# Altium project PROC114E3_SCH.PrjPcb (part 7 of 22)

## Sheet 18.SchDoc
size 513 x 386 mm
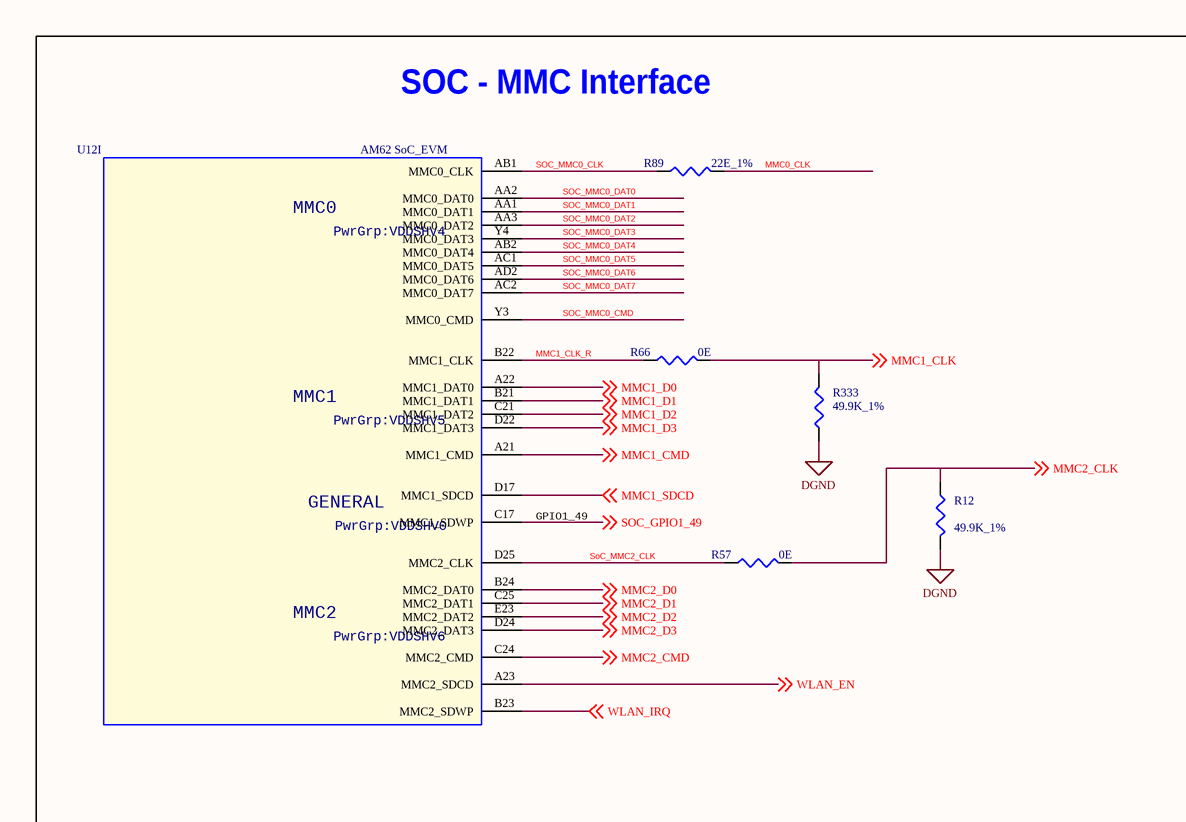
[diagram p27: 18.SchDoc, left]
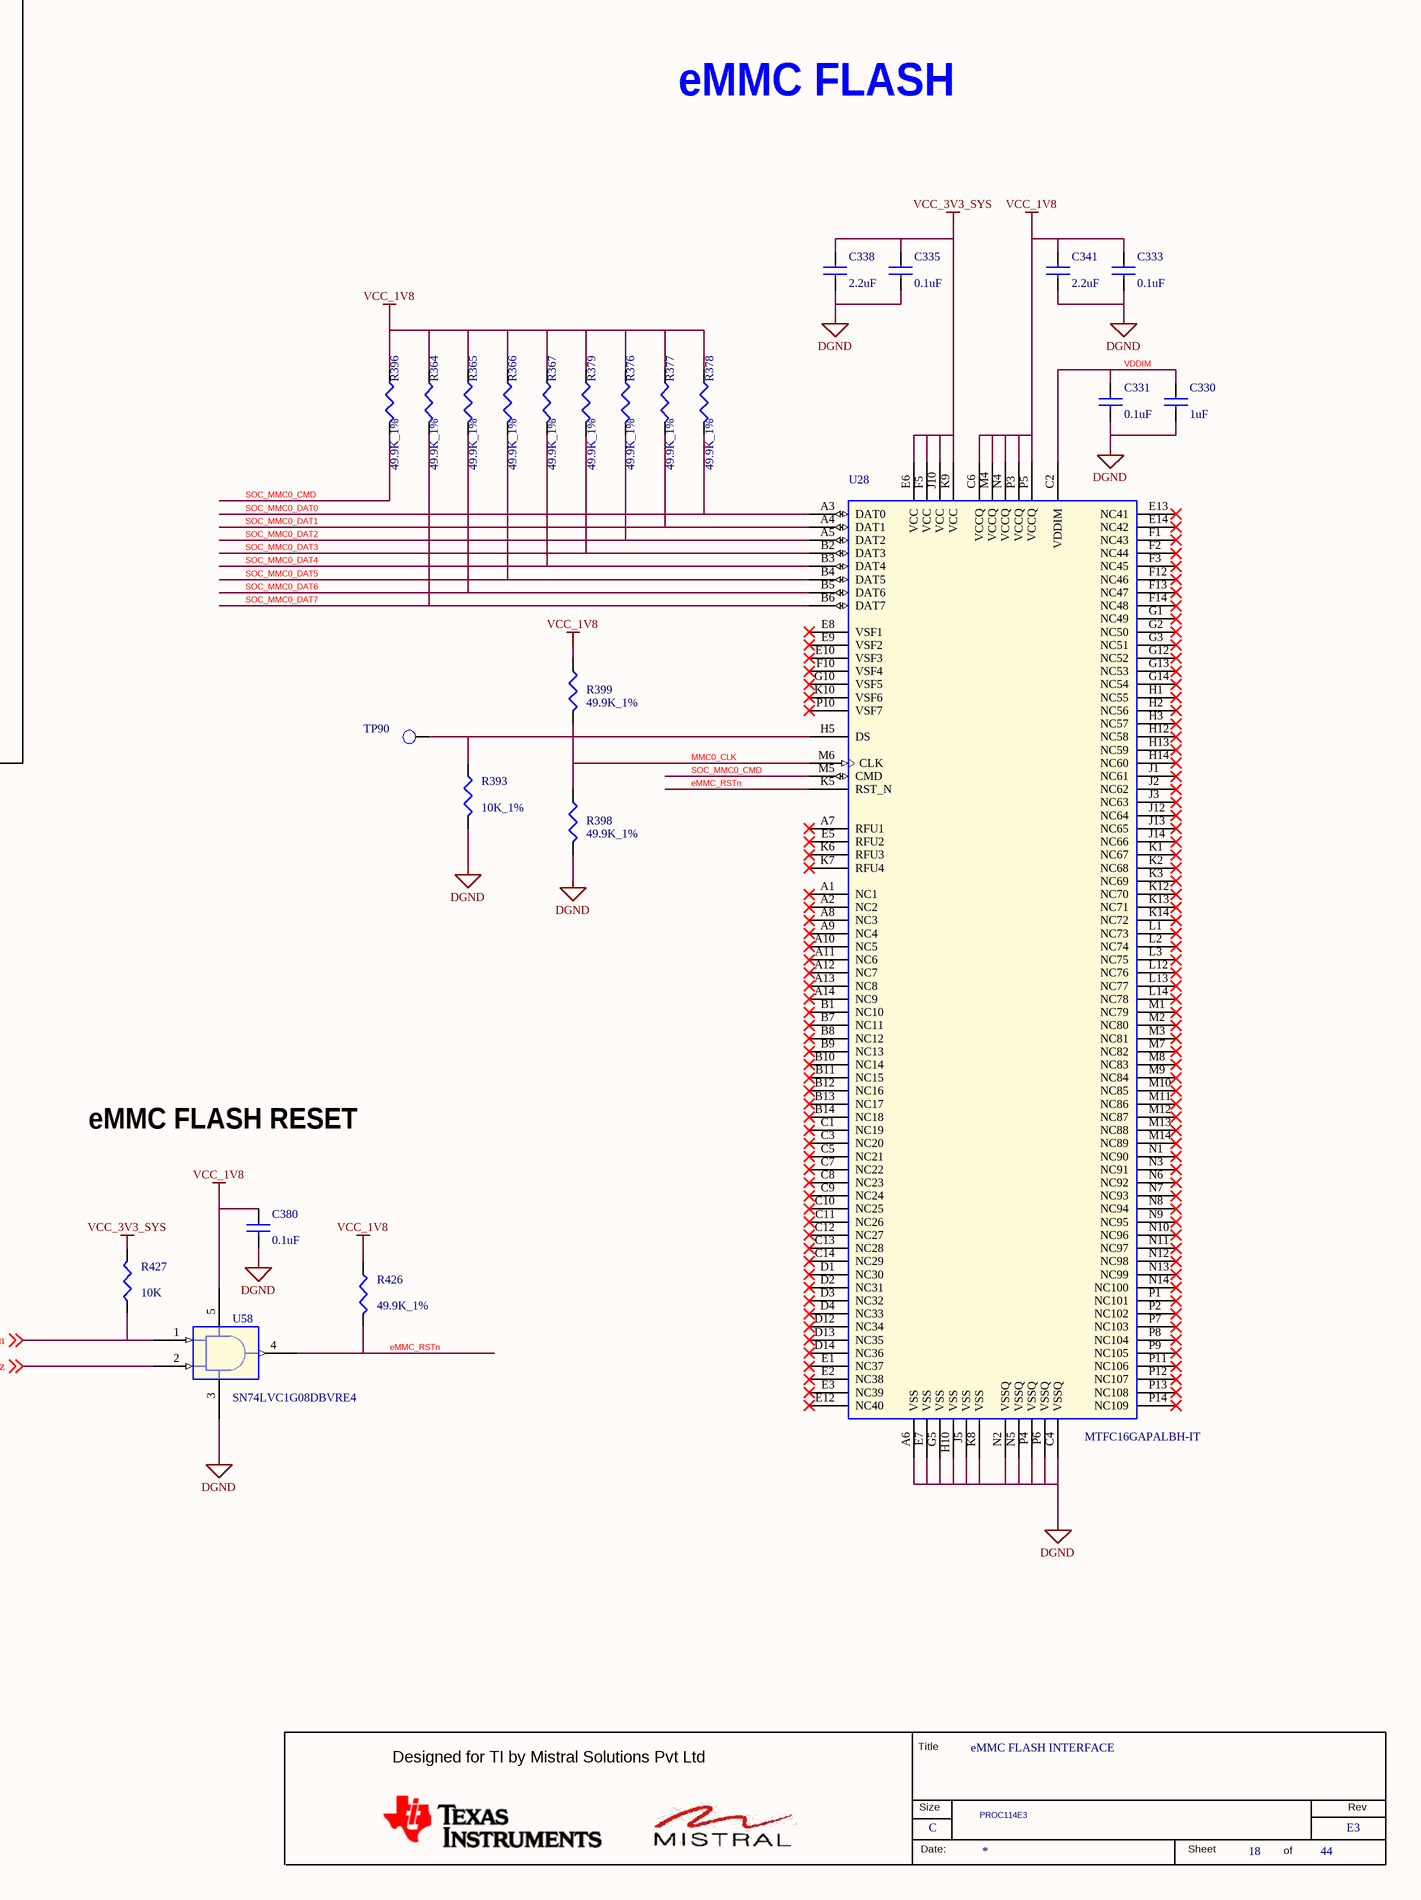
[diagram p28: 18.SchDoc, right]

### Parts
(Parts that share a designator on the sheet are numbered #1, #2 ... from top to bottom, then left to right.)
*#18  RevCode: E3  Title: eMMC FLASH INTERFACE  Page Size: C  Page Number: 18  Page Count: 44  Variant Name: PROC114E3  (hidden comment: MISTRAL_TITLEBLK_CSIZE)  (graphical)
C330  1uF  [CAP0201_0-5]
C331  0.1uF  [CAP0402_0-75]
C333  0.1uF  [CAP0402_0-75]
C335  0.1uF  [CAP0402_0-75]
C338  2.2uF  [CAP0402_0-75]
C341  2.2uF  [CAP0402_0-75]
C380  0.1uF  [CAP0402_0-75]
R12  49.9K_1%  [RES0402_0-5]
R57  0E  [RES0201_0-5]
R66  0E  [RES0201_0-5]
R89  22E_1%  [RES0201_0-5]
R333  49.9K_1%  [RES0402_0-5]
R364  49.9K_1%  [RES0201_0-5]
R365  49.9K_1%  [RES0201_0-5]
R366  49.9K_1%  [RES0201_0-5]
R367  49.9K_1%  [RES0201_0-5]
R376  49.9K_1%  [RES0201_0-5]
R377  49.9K_1%  [RES0201_0-5]
R378  49.9K_1%  [RES0201_0-5]
R379  49.9K_1%  [RES0201_0-5]
R393  10K_1%  [RES0201_0-5]
R396  49.9K_1%  [RES0201_0-5]
R398  49.9K_1%  [RES0402_0-5]
R399  49.9K_1%  [RES0402_0-5]
R426  49.9K_1%  [RES0402_0-5]
R427  10K  [RES0201_0-5]
TP90  TP20_SMD  [TP20_SMD]  (value not drawn)
U12#2  AM62 SoC_EVM  [BGA425_19-68_510X510_0-7]  (part I of 18)
U28  MTFC16GAPALBH-IT  [VFBGA153_19-68_460X520_1-1]
U58  SN74LVC1G08DBVRE4  [SOT23-5]

### Blocks framed on the sheet
SOC - MMC Interface: R12 R57 R66 R89 R333 U12#2

### Nets
DGND: C330.2 C331.2 C333.2 C335.2 C338.2 C341.2 C380.2 R12.2 R333.2 R393.2 R398.2 U28.A6(VSS) U28.C4(VSSQ) U28.E7(VSS) U28.G5(VSS) U28.H10(VSS) U28.J5(VSS) U28.K8(VSS) U28.N2(VSSQ) U28.N5(VSSQ) U28.P4(VSSQ) U28.P6(VSSQ) U58.3(GND)
VCC_1V8: C333.1 C341.1 C380.1 R364.1 R365.1 R366.1 R367.1 R376.1 R377.1 R378.1 R379.1 R396.1 R399.1 R426.1 U28.C6(VCCQ) U28.M4(VCCQ) U28.N4(VCCQ) U28.P3(VCCQ) U28.P5(VCCQ) U58.5(VCC)
VCC_3V3_SYS: C335.1 C338.1 R427.2 U28.E6(VCC) U28.F5(VCC) U28.J10(VCC) U28.K9(VCC)
eMMC_RSTn: R426.2 U28.K5(RST_N) U58.4(Y)
GPIO_eMMC_RSTn: R427.1 U58.1(A) ; off-sheet GPIO_eMMC_RSTn
MMC0_CLK: R89.1 R398.1 R399.2 U28.M6(CLK)
MMC1_CLK: R66.1 R333.1 ; off-sheet MMC1_CLK
MMC1_CLK_R: R66.2 U12#2.B22(MMC1_CLK)
MMC1_CMD: U12#2.A21(MMC1_CMD) ; off-sheet MMC1_CMD
MMC1_D0: U12#2.A22(MMC1_DAT0) ; off-sheet MMC1_D0
MMC1_D1: U12#2.B21(MMC1_DAT1) ; off-sheet MMC1_D1
MMC1_D2: U12#2.C21(MMC1_DAT2) ; off-sheet MMC1_D2
MMC1_D3: U12#2.D22(MMC1_DAT3) ; off-sheet MMC1_D3
MMC1_SDCD: U12#2.D17(MMC1_SDCD) ; off-sheet MMC1_SDCD
MMC2_CLK: R12.1 R57.2 ; off-sheet MMC2_CLK
MMC2_CMD: U12#2.C24(MMC2_CMD) ; off-sheet MMC2_CMD
MMC2_D0: U12#2.B24(MMC2_DAT0) ; off-sheet MMC2_D0
MMC2_D1: U12#2.C25(MMC2_DAT1) ; off-sheet MMC2_D1
MMC2_D2: U12#2.E23(MMC2_DAT2) ; off-sheet MMC2_D2
MMC2_D3: U12#2.D24(MMC2_DAT3) ; off-sheet MMC2_D3
RESETSTATz: U58.2(B) ; off-sheet RESETSTATz
SOC_GPIO1_49: U12#2.C17(MMC1_SDWP) ; off-sheet SOC_GPIO1_49
SOC_MMC0_CLK: R89.2 U12#2.AB1(MMC0_CLK)
SOC_MMC0_CMD: R396.2 U12#2.Y3(MMC0_CMD) U28.M5(CMD)
SOC_MMC0_DAT0: R378.2 U12#2.AA2(MMC0_DAT0) U28.A3(DAT0)
SOC_MMC0_DAT1: R377.2 U12#2.AA1(MMC0_DAT1) U28.A4(DAT1)
SOC_MMC0_DAT2: R376.2 U12#2.AA3(MMC0_DAT2) U28.A5(DAT2)
SOC_MMC0_DAT3: R379.2 U12#2.Y4(MMC0_DAT3) U28.B2(DAT3)
SOC_MMC0_DAT4: R367.2 U12#2.AB2(MMC0_DAT4) U28.B3(DAT4)
SOC_MMC0_DAT5: R366.2 U12#2.AC1(MMC0_DAT5) U28.B4(DAT5)
SOC_MMC0_DAT6: R365.2 U12#2.AD2(MMC0_DAT6) U28.B5(DAT6)
SOC_MMC0_DAT7: R364.2 U12#2.AC2(MMC0_DAT7) U28.B6(DAT7)
SoC_MMC2_CLK: R57.1 U12#2.D25(MMC2_CLK)
VDDIM: C330.1 C331.1 U28.C2(VDDIM)
WLAN_EN: U12#2.A23(MMC2_SDCD) ; off-sheet WLAN_EN
WLAN_IRQ: U12#2.B23(MMC2_SDWP) ; off-sheet WLAN_IRQ
NetR393_1: R393.1 TP90.1(TP) U28.H5(DS)

Not connected (* = marked no-connect by the designer): U28 A1(NC1)* A2(NC2)* A7(RFU1)* A8(NC3)* A9(NC4)* A10(NC5)* A11(NC6)* A12(NC7)* A13(NC8)* A14(NC9)* B1(NC10)* B7(NC11)* B8(NC12)* B9(NC13)* B10(NC14)* B11(NC15)* B12(NC16)* B13(NC17)* B14(NC18)* C1(NC19)* C3(NC20)* C5(NC21)* C7(NC22)* C8(NC23)* C9(NC24)* C10(NC25)* C11(NC26)* C12(NC27)* C13(NC28)* C14(NC29)* D1(NC30)* D2(NC31)* D3(NC32)* D4(NC33)* D12(NC34)* D13(NC35)* D14(NC36)* E1(NC37)* E2(NC38)* E3(NC39)* E5(RFU2)* E8(VSF1)* E9(VSF2)* E10(VSF3)* E12(NC40)* E13(NC41)* E14(NC42)* F1(NC43)* F2(NC44)* F3(NC45)* F10(VSF4)* F12(NC46)* F13(NC47)* F14(NC48)* G1(NC49)* G2(NC50)* G3(NC51)* G10(VSF5)* G12(NC52)* G13(NC53)* G14(NC54)* H1(NC55)* H2(NC56)* H3(NC57)* H12(NC58)* H13(NC59)* H14(NC60)* J1(NC61)* J2(NC62)* J3(NC63)* J12(NC64)* J13(NC65)* J14(NC66)* K1(NC67)* K2(NC68)* K3(NC69)* K6(RFU3)* K7(RFU4)* K10(VSF6)* K12(NC70)* K13(NC71)* K14(NC72)* L1(NC73)* L2(NC74)* L3(NC75)* L12(NC76)* L13(NC77)* L14(NC78)* M1(NC79)* M2(NC80)* M3(NC81)* M7(NC82)* M8(NC83)* M9(NC84)* M10(NC85)* M11(NC86)* M12(NC87)* M13(NC88)* M14(NC89)* N1(NC90)* N3(NC91)* N6(NC92)* N7(NC93)* N8(NC94)* N9(NC95)* N10(NC96)* N11(NC97)* N12(NC98)* N13(NC99)* N14(NC100)* P1(NC101)* P2(NC102)* P7(NC103)* P8(NC104)* P9(NC105)* P10(VSF7)* P11(NC106)* P12(NC107)* P13(NC108)* P14(NC109)*

### Notes on the sheet
- eMMC FLASH
- GPIO1_49
- eMMC FLASH RESET
- (in symbol AM62-EVM_BGA425, part I) MMC0; PwrGrp:VDDSHV4; MMC1; PwrGrp:VDDSHV5; GENERAL; PwrGrp:VDDSHV0; MMC2; PwrGrp:VDDSHV6
- (in symbol MISTRAL_TITLEBLK_CSIZE) Title; Designed for TI by Mistral Solutions Pvt Ltd; Size; Rev; Date:; Sheet; of

### Library data of the parts
*#18 = MISTRAL_TITLEBLK_CSIZE: Issue: 1.0; Page Create Date: March  8, 1995; Page Modify Date: *; Schematic Page Count: 44; Schematic Page Number: 18
C330 = CAP_Dup2: CAP CERAMIC 1uF 16V 20% X5R 0201; Part_type: CAPACITORS\CERAMIC; Mfr_part_number: GRM033R61C105ME15D; Mfr_name: MURATA; Mistral Part No: 120018090038-R; Custom_Duty: 15%; Customs_HS_Code: 85322990; Project: QCS610_NANOSOM; Wattage: NA; Footprint Ref: CAP0201_0-5; Library Ref: CAP; Chkd/date: MANIRAJA/300520; Crtd /date: ALVY/260520; Datasheet: Y:\MIS_DATABASE\DATASHEETS\CAPACITORS\GRM033R61C105ME15.PDF; Temperature: -55°C+85°C; Weight: 0.33mg; Height: 0.39MM; Distributor_part_number: 490-18654-1-ND; Distributor_name: DIGIKEY; Package: 0201; Voltage: 16V; Tolerance: 20%; MECHANICAL 3D STEP FILE: CAP0201_0-5; Library Path: Y:\MIS_DATABASE\Library\ALTIUM_TOOL\SCHEMATICS_PARTS\MS_DISCRETE_Library.schlib; Footprint Path: Y:\MIS_DATABASE\Library\ALTIUM_TOOL\PCB_FOOTPRINTS\Altium_Footprint_Lib.PcbLib; PCB Footprint: CAP0201_0-5
C331 C333 = CAP_Dup2: CAP CERAMIC 0.1uF 50V 10% X7R 0402; Alt_Mfr_part_number: CC0402KRX5R8BB104; Mistral Part No: 120011100014-R; Mfr_name: MURATA; Mfr_part_number: GRM155R71H104KE14D; Part_type: CAPACITORS\CERAMIC; Alt_Mfr_name: YAGEO AMERICA; Project: J7_CP; Wattage: NA; Customs_HS_Code: 85322990; Custom_Duty: 15%; Tolerance: 10%; Voltage: 50V; Package: 0402; Distributor_name: DIGIKEY; Distributor_part_number: 490-10700-1-ND; Height: 0.55MM; Weight: 3.1mg; Temperature: -55°C+125°C; Datasheet: Y:\MIS_DATABASE\DATASHEETS\CAPACITORS\GRM155R71H104KE14.PDF; Crtd /date: ALVY/211020; Chkd/date: MANIRAJA/261020; MECHANICAL 3D STEP FILE: CAP0402_0-75; Library Ref: CAP; Footprint Ref: CAP0402_0-75; Library Path: Y:\MIS_DATABASE\Library\ALTIUM_TOOL\SCHEMATICS_PARTS\MS_DISCRETE_Library.schlib; Footprint Path: Y:\MIS_DATABASE\Library\ALTIUM_TOOL\PCB_FOOTPRINTS\Altium_Footprint_Lib.PcbLib; PCB Footprint: CAP0402_0-75
C335 C380 = CAP_Dup2: CAP CERAMIC 0.1uF 50V 10% X7R 0402; Alt_Mfr_name: YAGEO AMERICA; Part_type: CAPACITORS\CERAMIC; Mfr_part_number: GRM155R71H104KE14D; Mfr_name: MURATA; Mistral Part No: 120011100014-R; Alt_Mfr_part_number: CC0402KRX5R8BB104; Custom_Duty: 15%; Customs_HS_Code: 85322990; Wattage: NA; Project: J7_CP; Footprint Path: Y:\MIS_DATABASE\Library\ALTIUM_TOOL\PCB_FOOTPRINTS\Altium_Footprint_Lib.PcbLib; Library Path: Y:\MIS_DATABASE\Library\ALTIUM_TOOL\SCHEMATICS_PARTS\MS_DISCRETE_Library.schlib; Footprint Ref: CAP0402_0-75; Library Ref: CAP; MECHANICAL 3D STEP FILE: CAP0402_0-75; Chkd/date: MANIRAJA/261020; Crtd /date: ALVY/211020; Datasheet: Y:\MIS_DATABASE\DATASHEETS\CAPACITORS\GRM155R71H104KE14.PDF; Temperature: -55°C+125°C; Weight: 3.1mg; Height: 0.55MM; Distributor_part_number: 490-10700-1-ND; Distributor_name: DIGIKEY; Package: 0402; Voltage: 50V; Tolerance: 10%; PCB Footprint: CAP0402_0-75
C338 = CAP_Dup2: CAP CERAMIC 2.2uF 25V 10% X5R 0402; Part_type: CAPACITORS\CERAMIC; Mfr_part_number: GRM155R61E225KE11D; Mfr_name: MURATA; Mistral Part No: 120015120001-R; Custom_Duty: 15%; Customs_HS_Code: 85322990; Wattage: NA; Project: TI_AM263X_CC; Footprint Path: Y:\MIS_DATABASE\Library\ALTIUM_TOOL\PCB_FOOTPRINTS\Altium_Footprint_Lib.PcbLib; Library Path: Y:\MIS_DATABASE\Library\ALTIUM_TOOL\SCHEMATICS_PARTS\MS_DISCRETE_Library.schlib; Footprint Ref: CAP0402_0-75; MECHANICAL 3D STEP FILE: CAP0402_0-75; Chkd/date: ALVY/010721; Crtd /date: MANIRAJA/010721; Datasheet: Y:\MIS_DATABASE\DATASHEETS\CAPACITORS\GRM155R61E225KE11.PDF; Temperature: -55°C+85°C; Weight: 1.5mg; Height: 0.70MM; Distributor_part_number: 490-12703-1-ND; Distributor_name: DIGIKEY; Package: 0402; Voltage: 25V; Tolerance: 10%; Library Ref: CAP; PCB Footprint: CAP0402_0-75
C341 = CAP_Dup2: CAP CERAMIC 2.2uF 25V 10% X5R 0402; Mistral Part No: 120015120001-R; Mfr_name: MURATA; Mfr_part_number: GRM155R61E225KE11D; Part_type: CAPACITORS\CERAMIC; Project: TI_AM263X_CC; Wattage: NA; Customs_HS_Code: 85322990; Custom_Duty: 15%; Library Ref: CAP; Tolerance: 10%; Voltage: 25V; Package: 0402; Distributor_name: DIGIKEY; Distributor_part_number: 490-12703-1-ND; Height: 0.70MM; Weight: 1.5mg; Temperature: -55°C+85°C; Datasheet: Y:\MIS_DATABASE\DATASHEETS\CAPACITORS\GRM155R61E225KE11.PDF; Crtd /date: MANIRAJA/010721; Chkd/date: ALVY/010721; MECHANICAL 3D STEP FILE: CAP0402_0-75; Footprint Ref: CAP0402_0-75; Library Path: Y:\MIS_DATABASE\Library\ALTIUM_TOOL\SCHEMATICS_PARTS\MS_DISCRETE_Library.schlib; Footprint Path: Y:\MIS_DATABASE\Library\ALTIUM_TOOL\PCB_FOOTPRINTS\Altium_Footprint_Lib.PcbLib; PCB Footprint: CAP0402_0-75
R12 R333 = RESISTOR_Dup6: RES 49.9K 1/16W 1% 0402; Part_type: RESISTORS\FIXED; Mfr_part_number: RC0402FR-0749K9L; Mfr_name: YAGEO AMERICA; Mistral Part No: 110009030902-R; Custom_Duty: 15%; Customs_HS_Code: 85332119; Voltage: NA; Project: PNAV; PCB Footprint: RES0402_0-5; MECHANICAL 3D STEP FILE: RES0402_0-5; Chkd/date: MAZHAR/220709; Crtd /date: GEETHA/090606; Datasheet: Y:\MIS_DATABASE\DATASHEETS\RESISTORS\RCXXXXL-SER_MAR18.PDF; Temperature: -55°C+155°C; Weight: 0.65mg; Height: 0.40MM; Distributor_part_number: 311-49.9KLRCT-ND; Distributor_name: DIGIKEY; Package: 0402; Wattage: 1/16W; Tolerance: 1%; Library Ref: RESISTOR; Footprint Ref: RES0402_0-5; Library Path: Y:\MIS_DATABASE\Library\ALTIUM_TOOL\SCHEMATICS_PARTS\MS_DISCRETE_Library.schlib; Footprint Path: Y:\MIS_DATABASE\Library\ALTIUM_TOOL\PCB_FOOTPRINTS\Altium_Footprint_Lib.PcbLib
R57 = RESISTOR_Dup6: RES 0E 1/20W 5% 0201; Mistral Part No: 110010070067-R; Mfr_name: YAGEO AMERICA; Mfr_part_number: RC0201JR-070RL; Part_type: RESISTORS\FIXED; SIGNAL_MODEL: RESISTOR_RES0201_0-5_0E_0E; Project: PB_BUGBASE; Voltage: NA; Customs_HS_Code: 85332119; Custom_Duty: 15%; PCB Footprint: RES0201_0-5; Footprint Ref: RES0201_0-5; Tolerance: 5%; Wattage: 1/20W; Package: 0201; Distributor_name: DIGIKEY; Distributor_part_number: 311-0.0NCT-ND; Library Ref: RESISTOR; Height: 0.26MM; Weight: 0.17mg; Temperature: -55°C+125°C; Datasheet: Y:\MIS_DATABASE\DATASHEETS\RESISTORS\RCXXXXL-SER_MAR18.PDF; Crtd /date: MUDDU/120710; Chkd/date: NAVEED/301214; MECHANICAL 3D STEP FILE: RES0201_0-5; Library Path: Y:\MIS_DATABASE\Library\ALTIUM_TOOL\SCHEMATICS_PARTS\MS_DISCRETE_Library.schlib; Footprint Path: Y:\MIS_DATABASE\Library\ALTIUM_TOOL\PCB_FOOTPRINTS\Altium_Footprint_Lib.PcbLib
R66 = RESISTOR_Dup6: RES 0E 1/20W 5% 0201; Part_type: RESISTORS\FIXED; Mfr_part_number: RC0201JR-070RL; Mfr_name: YAGEO AMERICA; Mistral Part No: 110010070067-R; SIGNAL_MODEL: RESISTOR_RES0201_0-5_0E_0E; Custom_Duty: 15%; Customs_HS_Code: 85332119; Voltage: NA; Project: PB_BUGBASE; Footprint Path: Y:\MIS_DATABASE\Library\ALTIUM_TOOL\PCB_FOOTPRINTS\Altium_Footprint_Lib.PcbLib; Library Path: Y:\MIS_DATABASE\Library\ALTIUM_TOOL\SCHEMATICS_PARTS\MS_DISCRETE_Library.schlib; MECHANICAL 3D STEP FILE: RES0201_0-5; Chkd/date: NAVEED/301214; Crtd /date: MUDDU/120710; Datasheet: Y:\MIS_DATABASE\DATASHEETS\RESISTORS\RCXXXXL-SER_MAR18.PDF; Temperature: -55°C+125°C; Weight: 0.17mg; Height: 0.26MM; Library Ref: RESISTOR; Distributor_part_number: 311-0.0NCT-ND; Distributor_name: DIGIKEY; Package: 0201; Wattage: 1/20W; Tolerance: 5%; Footprint Ref: RES0201_0-5; PCB Footprint: RES0201_0-5
R89 = RESISTOR_Dup1: RES 22E 1/20W 1% 0201; Part_type: RESISTORS\FIXED; Mfr_part_number: ERJ-1GEF22R0C; Mfr_name: PANASONIC-ECG; Mistral Part No: 110009030522-R; SIGNAL_MODEL: RESISTOR_RES0201_0-5_22E_1%_22E_1%; Custom_Duty: 15%; Customs_HS_Code: 85332119; Voltage: NA; Project: V8TS; Footprint Path: Y:\MIS_DATABASE\Library\ALTIUM_TOOL\PCB_FOOTPRINTS\Altium_Footprint_Lib.PcbLib; Library Path: Y:\MIS_DATABASE\Library\ALTIUM_TOOL\SCHEMATICS_PARTS\MS_DISCRETE_Library.schlib; MECHANICAL 3D STEP FILE: RES0201_0-5; Chkd/date: MAZHAR/140709; Crtd /date: MAZHAR/220807; Datasheet: Y:\MIS_DATABASE\DATASHEETS\RESISTORS\PAN-ERJSER_NOV17.PDF; Temperature: -55°C+125°C; Weight: 0.15mg; Height: 0.26MM; Library Ref: RESISTOR; Distributor_part_number: P22.0ABCT-ND; Distributor_name: DIGIKEY; Package: 0201; Wattage: 1/20W; Tolerance: 1%; Footprint Ref: RES0201_0-5; PCB Footprint: RES0201_0-5
R364 R365 R377 R379 = RESISTOR_Dup6: RES 49.9K 1/20W 1% 0201; Mistral Part No: 110009030900-R; Mfr_name: YAGEO AMERICA; Mfr_part_number: RC0201FR-0749K9L; Part_type: RESISTORS\FIXED; Project: TI_AM62x_SKEVM_BRD; Customs_HS_Code: 85332119; Custom_Duty: 15%; Voltage: NA; Library Ref: RESISTOR; Tolerance: 1%; Wattage: 1/20W; Package: 0201; Distributor_name: DIGIKEY; Distributor_part_number: YAG2701CT-ND; Height: 0.26MM; Datasheet: Y:\MIS_DATABASE\DATASHEETS\RESISTORS\ERJ-1J.PDF; Crtd /date: TAMILARASU/070422; Chkd/date: ALVY/070422; Footprint Ref: RES0201_0-5; Weight: 0.17mg; Temperature: -55°C+125°C; MECHANICAL 3D STEP FILE: RES0201_0-5; Library Path: Y:\MIS_DATABASE\Library\ALTIUM_TOOL\SCHEMATICS_PARTS\MS_DISCRETE_Library.schlib; Footprint Path: Y:\MIS_DATABASE\Library\ALTIUM_TOOL\PCB_FOOTPRINTS\Altium_Footprint_Lib.PcbLib; PCB Footprint: RES0201_0-5
R366 R367 R376 R378 = RESISTOR_Dup6: RES 49.9K 1/20W 1% 0201; Part_type: RESISTORS\FIXED; Mfr_part_number: RC0201FR-0749K9L; Mfr_name: YAGEO AMERICA; Mistral Part No: 110009030900-R; Voltage: NA; Custom_Duty: 15%; Customs_HS_Code: 85332119; Project: TI_AM62x_SKEVM_BRD; Footprint Path: Y:\MIS_DATABASE\Library\ALTIUM_TOOL\PCB_FOOTPRINTS\Altium_Footprint_Lib.PcbLib; Library Path: Y:\MIS_DATABASE\Library\ALTIUM_TOOL\SCHEMATICS_PARTS\MS_DISCRETE_Library.schlib; MECHANICAL 3D STEP FILE: RES0201_0-5; Temperature: -55°C+125°C; Weight: 0.17mg; Footprint Ref: RES0201_0-5; Chkd/date: ALVY/070422; Crtd /date: TAMILARASU/070422; Datasheet: Y:\MIS_DATABASE\DATASHEETS\RESISTORS\ERJ-1J.PDF; Height: 0.26MM; Distributor_part_number: YAG2701CT-ND; Distributor_name: DIGIKEY; Package: 0201; Wattage: 1/20W; Tolerance: 1%; Library Ref: RESISTOR; PCB Footprint: RES0201_0-5
R393 = RESISTOR_Dup6: RES 10K 1/20W 1% 0201; Mistral Part No: 110011040018-R; Mfr_name: YAGEO AMERICA; Mfr_part_number: RC0201FR-0710KL; Part_type: RESISTORS\FIXED; Project: GOLDEN-I LITE; Voltage: NA; Customs_HS_Code: 85332119; Custom_Duty: 15%; Footprint Path: Y:\MIS_DATABASE\Library\ALTIUM_TOOL\PCB_FOOTPRINTS\Altium_Footprint_Lib.PcbLib; Library Path: Y:\MIS_DATABASE\Library\ALTIUM_TOOL\SCHEMATICS_PARTS\MS_DISCRETE_Library.schlib; Footprint Ref: RES0201_0-5; Library Ref: RESISTOR; Tolerance: 1%; Wattage: 1/20W; Package: 0201; Distributor_name: DIGIKEY; Distributor_part_number: 311-10.0KMCT-ND; Height: 0.26MM; Weight: 0.17mg; Temperature: -55°C+125°C; Datasheet: Y:\MIS_DATABASE\DATASHEETS\RESISTORS\RCXXXXL-SER_MAR18.PDF; Crtd /date: MANIRAJA/270117; Chkd/date: VASANTHA/270117; MECHANICAL 3D STEP FILE: RES0201_0-5; PCB Footprint: RES0201_0-5
R396 = RESISTOR_Dup6: RES 49.9K 1/20W 1% 0201; Mistral Part No: 110009030900-R; Mfr_name: YAGEO AMERICA; Mfr_part_number: RC0201FR-0749K9L; Part_type: RESISTORS\FIXED; Project: TI_AM62x_SKEVM_BRD; Voltage: NA; Customs_HS_Code: 85332119; Custom_Duty: 15%; Footprint Path: Y:\MIS_DATABASE\Library\ALTIUM_TOOL\PCB_FOOTPRINTS\Altium_Footprint_Lib.PcbLib; Library Path: Y:\MIS_DATABASE\Library\ALTIUM_TOOL\SCHEMATICS_PARTS\MS_DISCRETE_Library.schlib; Footprint Ref: RES0201_0-5; Library Ref: RESISTOR; Tolerance: 1%; Wattage: 1/20W; Package: 0201; Distributor_name: DIGIKEY; Distributor_part_number: YAG2701CT-ND; Height: 0.26MM; Weight: 0.17mg; Temperature: -55°C+125°C; Datasheet: Y:\MIS_DATABASE\DATASHEETS\RESISTORS\ERJ-1J.PDF; Crtd /date: TAMILARASU/070422; Chkd/date: ALVY/070422; MECHANICAL 3D STEP FILE: RES0201_0-5; PCB Footprint: RES0201_0-5
R398 R399 = RESISTOR_Dup6: RES 49.9K 1/16W 1% 0402; Mistral Part No: 110009030902-R; Mfr_name: YAGEO AMERICA; Mfr_part_number: RC0402FR-0749K9L; Part_type: RESISTORS\FIXED; Project: PNAV; Customs_HS_Code: 85332119; Custom_Duty: 15%; Voltage: NA; Library Ref: RESISTOR; Tolerance: 1%; Wattage: 1/16W; Package: 0402; Distributor_name: DIGIKEY; Distributor_part_number: 311-49.9KLRCT-ND; Height: 0.40MM; Datasheet: Y:\MIS_DATABASE\DATASHEETS\RESISTORS\RCXXXXL-SER_MAR18.PDF; Crtd /date: GEETHA/090606; Chkd/date: MAZHAR/220709; Footprint Ref: RES0402_0-5; Weight: 0.65mg; Temperature: -55°C+155°C; MECHANICAL 3D STEP FILE: RES0402_0-5; Library Path: Y:\MIS_DATABASE\Library\ALTIUM_TOOL\SCHEMATICS_PARTS\MS_DISCRETE_Library.schlib; Footprint Path: Y:\MIS_DATABASE\Library\ALTIUM_TOOL\PCB_FOOTPRINTS\Altium_Footprint_Lib.PcbLib; PCB Footprint: RES0402_0-5
R426 = RESISTOR_Dup6: RES 49.9K 1/16W 1% 0402; Mistral Part No: 110009030902-R; Mfr_name: YAGEO AMERICA; Mfr_part_number: RC0402FR-0749K9L; Part_type: RESISTORS\FIXED; Project: PNAV; Voltage: NA; Customs_HS_Code: 85332119; Custom_Duty: 15%; PCB Footprint: RES0402_0-5; Footprint Path: Y:\MIS_DATABASE\Library\ALTIUM_TOOL\PCB_FOOTPRINTS\Altium_Footprint_Lib.PcbLib; Library Path: Y:\MIS_DATABASE\Library\ALTIUM_TOOL\SCHEMATICS_PARTS\MS_DISCRETE_Library.schlib; Footprint Ref: RES0402_0-5; Library Ref: RESISTOR; Tolerance: 1%; Wattage: 1/16W; Package: 0402; Distributor_name: DIGIKEY; Distributor_part_number: 311-49.9KLRCT-ND; Height: 0.40MM; Weight: 0.65mg; Temperature: -55°C+155°C; Datasheet: Y:\MIS_DATABASE\DATASHEETS\RESISTORS\RCXXXXL-SER_MAR18.PDF; Crtd /date: GEETHA/090606; Chkd/date: MAZHAR/220709; MECHANICAL 3D STEP FILE: RES0402_0-5
R427 = RESISTOR_Dup6: RES 10K 1/20W 5% 0201; Part_type: RESISTORS\FIXED; Mfr_part_number: RC0201JR-0710KL; Mfr_name: YAGEO AMERICA; Mistral Part No: 110010070051-R; Custom_Duty: 15%; Customs_HS_Code: 85332119; Voltage: NA; Project: GOLDEN-I LITE; Footprint Path: Y:\MIS_DATABASE\Library\ALTIUM_TOOL\PCB_FOOTPRINTS\Altium_Footprint_Lib.PcbLib; Library Path: Y:\MIS_DATABASE\Library\ALTIUM_TOOL\SCHEMATICS_PARTS\MS_DISCRETE_Library.schlib; Footprint Ref: RES0201_0-5; Library Ref: RESISTOR; MECHANICAL 3D STEP FILE: RES0201_0-5; Chkd/date: MANIRAJA/050517; Crtd /date: MANIRAJA/050517; Datasheet: Y:\MIS_DATABASE\DATASHEETS\RESISTORS\RCXXXXL-SER_MAR18.PDF; Temperature: -55°C+125°C; Weight: 0.17mg; Height: 0.26MM; Distributor_part_number: 311-10KNCT-ND; Distributor_name: DIGIKEY; Package: 0201; Wattage: 1/20W; Tolerance: 5%; PCB Footprint: RES0201_0-5
TP90 = TESTPOINT: TESTPOINT CIR 20 SMD; Mistral Part No: NA; Mfr_name: LOCAL; Project: BT MODULE_CSRBC04; RoHS: NA; Mfr_part_number: TP20_SMD; Part_type: TESTPOINT; Package: SMD; Distributor_name: NA; Distributor_part_number: NA; Height: NA; Crtd /date: MAZHAR/171006; Chkd/date: SHREESHAIL/171006; Tolerance: NA; Voltage: NA; Wattage: NA; Weight: NA; Temperature: NA; Datasheet: NA; MECHANICAL 3D STEP FILE: NA; Library Path: Y:\MIS_DATABASE\Library\ALTIUM_TOOL\SCHEMATICS_PARTS\MS_DISCRETE_Library.schlib; Footprint Path: Y:\MIS_DATABASE\Library\ALTIUM_TOOL\PCB_FOOTPRINTS\Altium_Footprint_Lib.PcbLib; Library Ref: TESTPOINT; Footprint Ref: TP20_SMD; Customs_HS_Code: NA; Custom_Duty: NA; PCB Footprint: TP20_SMD
U12#2 = AM62-EVM_BGA425: IC AM62 SoC MICROPROCESSOR BGA425; Mistral Part No: 141221060001; Mfr_name: TEXAS INSTRUMENTS; Part_type: ICS\DIGITAL\MICROPROCESSOR; Project: AM62_EVM_BRD; Tolerance: NA; Customs_HS_Code: 85423100; Custom_Duty: 15%; PCB Footprint: BGA425_19-68_510X510_0-7; Mfr_part_number: AM62 SoC_EVM; Voltage: NA; Wattage: NA; Package: BGA425; Distributor_name: NA; Distributor_part_number: NA; Library Ref: AM62-EVM_BGA425; Footprint Ref: BGA425_19-68_510X510_0-7; Height: 0.65MM; Weight: NA; Temperature: NA; Datasheet: Y:\MIS_DATABASE\DATASHEETS\ICS\DIGITAL\MICROCONTROLLER\AM62-SoC_SVB.PDF; Crtd /date: MANIRAJA/110621; Chkd/date: ALVY/110621; RoHS: NA; MECHANICAL 3D STEP FILE: BGA425_19-68_510X510_0-7; Library Path: Y:\MIS_DATABASE\Library\ALTIUM_TOOL\SCHEMATICS_PARTS\MS_MICROPROCESSOR_Library.schlib; Footprint Path: Y:\MIS_DATABASE\Library\ALTIUM_TOOL\PCB_FOOTPRINTS\Altium_Footprint_Lib.PcbLib
U28 = MTFC16GAPALBH_TFBGA153: IC 16GB e-MMC MEMORY TFBGA153; Mistral Part No: 141120020001-R; Mfr_name: MICRON; Part_type: ICS\DIGITAL\MEMORY; Project: TI_MAXIE_CPB; Tolerance: NA; Customs_HS_Code: 85423100; Custom_Duty: 15%; Footprint Ref: VFBGA153_19-68_460X520_1-1; Mfr_part_number: MTFC16GAPALBH-IT; Voltage: NA; Wattage: NA; Package: TFBGA153; Distributor_name: DIGIKEY; Distributor_part_number: MTFC16GAPALBH-IT-ND; Library Ref: MTFC16GAPALBH_TFBGA153; Height: 1.10MM; Weight: NA; Temperature: -40°C+85°C; Datasheet: Y:\MIS_DATABASE\DATASHEETS\ICS\MEMORY\MTFCXX-IT.PDF; Crtd /date: ALVY/070220; Chkd/date: MANIRAJA/070220; MECHANICAL 3D STEP FILE: VFBGA153_19-68_460X520_1-1; Library Path: Y:\MIS_DATABASE\Library\ALTIUM_TOOL\SCHEMATICS_PARTS\MS_MISCMEMORY_Library.schlib; Footprint Path: Y:\MIS_DATABASE\Library\ALTIUM_TOOL\PCB_FOOTPRINTS\Altium_Footprint_Lib.PcbLib; PCB Footprint: VFBGA153_19-68_460X520_1-1
U58 = SN74LVC1G08DBVRE4_SOT23-5_Dup1: IC SINGLE 2-INPUT POSITIVE AND GATE SOT23-5; Mistral Part No: 141009060026-R; Mfr_name: TEXAS INSTRUMENTS; Part_type: ICS\DIGITAL\GATES; Project: KHAN_MAIN; Customs_HS_Code: 85423100; Custom_Duty: 15%; Mfr_part_number: SN74LVC1G08DBVRE4; Package: SOT23-5; Distributor_name: DIGIKEY; Distributor_part_number: SN74LVC1G08DBVRE4-ND; Library Ref: SN74LVC1G08DBVRE4_SOT23-5; Height: 1.45MM; Temperature: -40°C+85°C; Datasheet: Y:\MIS_DATABASE\DATASHEETS\ICS\DIGITAL\GATES\SN74LVC1G08.PDF; Crtd /date: USMAN/151008; Chkd/date: SUHAS/221010; RoHS: Sb/ Br FREE; PCB Footprint: SOT23-5

## Sheet 19.SchDoc
size 513 x 386 mm
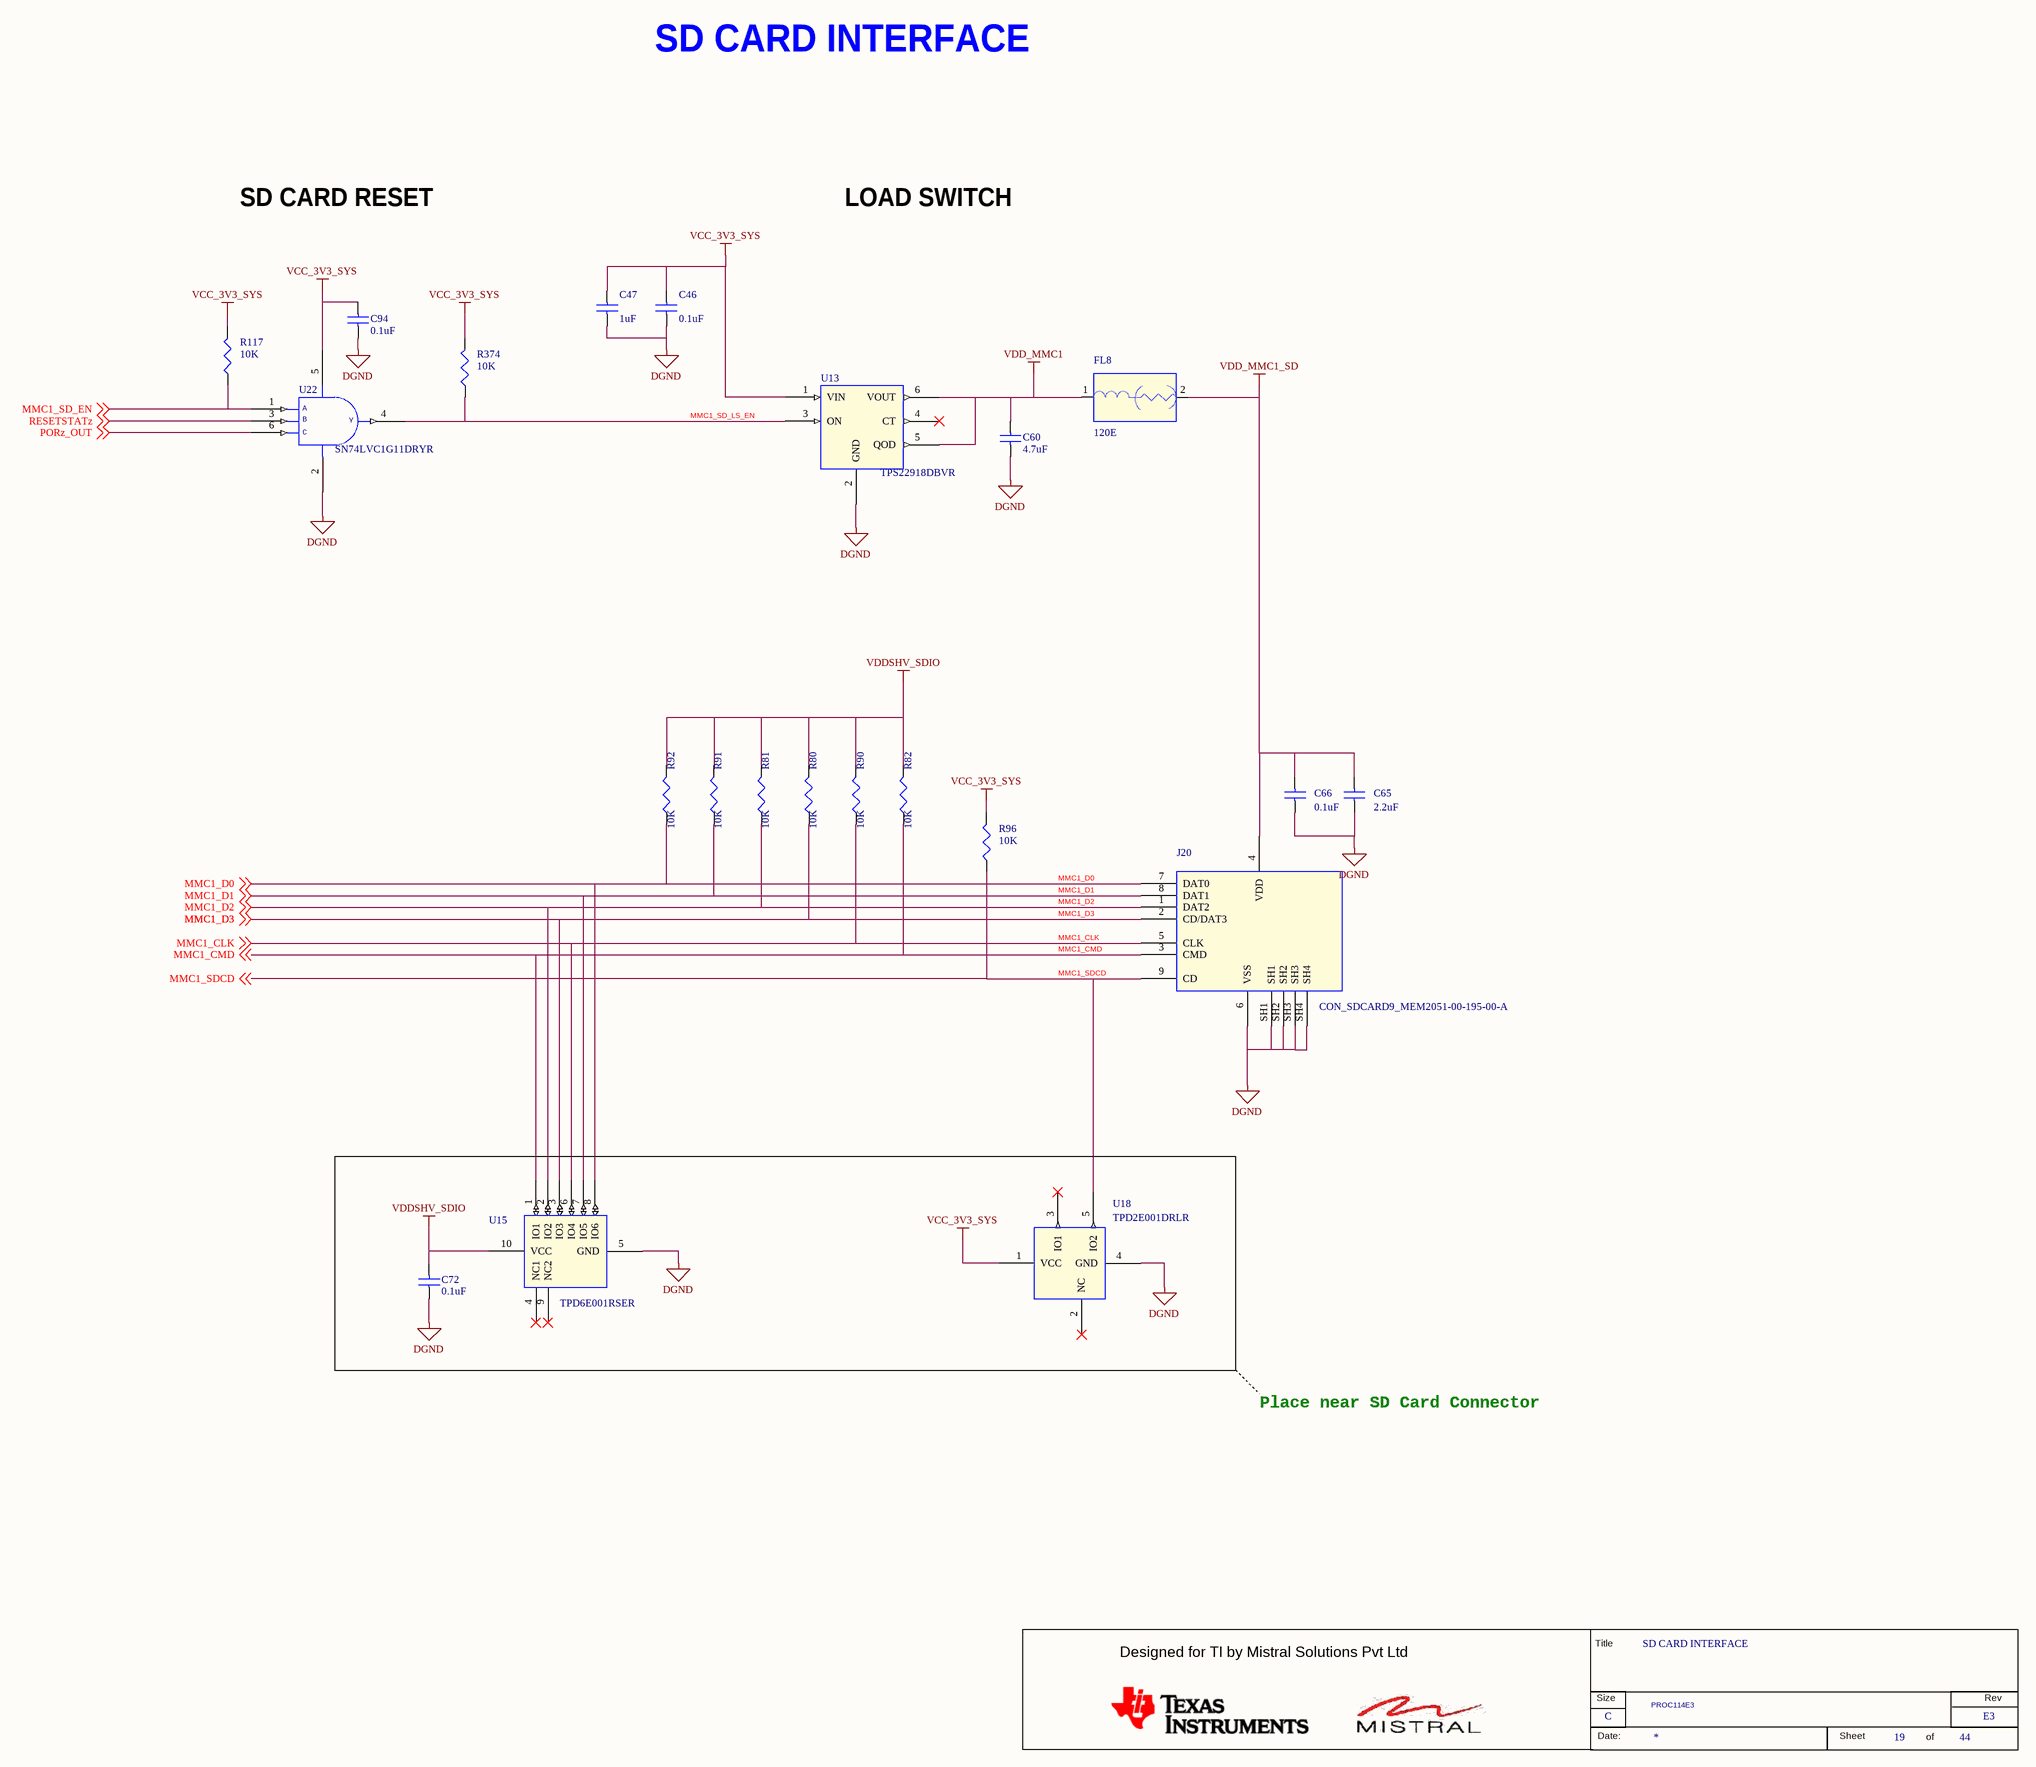
[diagram p29: 19.SchDoc]

### Parts
(Parts that share a designator on the sheet are numbered #1, #2 ... from top to bottom, then left to right.)
*#19  RevCode: E3  Title: SD CARD INTERFACE  Page Size: C  Page Number: 19  Page Count: 44  Variant Name: PROC114E3  (hidden comment: MISTRAL_TITLEBLK_CSIZE)  (graphical)
C46  0.1uF  [CAP0402_0-75]
C47  1uF  [CAP0201_0-5]
C60  4.7uF  [CAP0402_0-75]
C65  2.2uF  [CAP0402_0-75]
C66  0.1uF  [CAP0402_0-75]
C72  0.1uF  [CAP0402_0-75]
C94  0.1uF  [CAP0402_0-75]
FL8  120E  [EMIFIL_BLM15A_0402_0-6]
J20  CON_SDCARD9_MEM2051-00-195-00-A  [CON_SD9_MEM2051-00-195-00_S_R_S_2-1]
R80  10K  [RES0201_0-5]
R81  10K  [RES0201_0-5]
R82  10K  [RES0201_0-5]
R90  10K  [RES0201_0-5]
R91  10K  [RES0201_0-5]
R92  10K  [RES0201_0-5]
R96  10K  [RES0201_0-5]
R117  10K  [RES0201_0-5]
R374  10K  [RES0201_0-5]
U13  TPS22918DBVR  [SOT23-6]
U15  TPD6E001RSER  [UQFN10_19-68_80X60_0-6]
U18  TPD2E001DRLR  [SOT553-5_0-6]
U22  SN74LVC1G11DRYR  [SON6_SN74LVC2G17_40X60_0-6]

### Nets
DGND: C46.2 C47.2 C60.2 C65.1 C66.1 C72.1 C94.2 J20.6(VSS) J20.SH1 J20.SH2 J20.SH3 J20.SH4 U13.2(GND) U15.5(GND) U18.4(GND) U22.2(GND)
VCC_3V3_SYS: C46.1 C47.1 C94.1 R96.2 R117.2 R374.2 U13.1(VIN) U18.1(VCC) U22.5(VCC)
VDD_MMC1: C60.1 FL8.1 U13.5(QOD) U13.6(VOUT)
VDD_MMC1_SD: C65.2 C66.2 FL8.2 J20.4(VDD)
VDDSHV_SDIO: C72.2 R80.2 R81.2 R82.2 R90.2 R91.2 R92.2 U15.10(VCC)
MMC1_CLK: J20.5(CLK) R90.1 U15.6(IO4) ; off-sheet MMC1_CLK
MMC1_CMD: J20.3(CMD) R82.1 U15.1(IO1) ; off-sheet MMC1_CMD
MMC1_D0: J20.7(DAT0) R92.1 U15.8(IO6) ; off-sheet MMC1_D0
MMC1_D1: J20.8(DAT1) R91.1 U15.7(IO5) ; off-sheet MMC1_D1
MMC1_D2: J20.1(DAT2) R81.1 U15.2(IO2) ; off-sheet MMC1_D2
MMC1_D3: J20.2(CD/DAT3) R80.1 U15.3(IO3) ; off-sheet MMC1_D3
MMC1_SD_EN: R117.1 U22.1(A) ; off-sheet MMC1_SD_EN
MMC1_SD_LS_EN: R374.1 U13.3(ON) U22.4(Y)
MMC1_SDCD: J20.9(CD) R96.1 U18.5(IO2) ; off-sheet MMC1_SDCD
PORz_OUT: U22.6(C) ; off-sheet PORz_OUT
RESETSTATz: U22.3(B) ; off-sheet RESETSTATz

Not connected (* = marked no-connect by the designer): U13 4(CT)*; U15 4(NC1)* 9(NC2)*; U18 2(NC)* 3(IO1)*

### Notes on the sheet
- SD CARD INTERFACE
- SD CARD RESET
- LOAD SWITCH
- Place near SD Card Connector
- (in symbol MISTRAL_TITLEBLK_CSIZE) Title; Designed for TI by Mistral Solutions Pvt Ltd; Size; Rev; Date:; Sheet; of

### Library data of the parts
*#19 = MISTRAL_TITLEBLK_CSIZE: Issue: 1.0; Page Create Date: March  8, 1995; Page Modify Date: *; Schematic Page Count: 44; Schematic Page Number: 19
C46 C66 C94 = CAP_Dup2: as C331 on sheet 18; Tolerance: 10%; Voltage: 50V; Package: 0402; Distributor_name: DIGIKEY; Distributor_part_number: 490-10700-1-ND; Height: 0.55MM; Weight: 3.1mg; Temperature: -55°C+125°C; Datasheet: Y:\MIS_DATABASE\DATASHEETS\CAPACITORS\GRM155R71H104KE14.PDF; Crtd /date: ALVY/211020; Chkd/date: MANIRAJA/261020; MECHANICAL 3D STEP FILE: CAP0402_0-75; Library Ref: CAP; Footprint Ref: CAP0402_0-75; Library Path: Y:\MIS_DATABASE\Library\ALTIUM_TOOL\SCHEMATICS_PARTS\MS_DISCRETE_Library.schlib; Footprint Path: Y:\MIS_DATABASE\Library\ALTIUM_TOOL\PCB_FOOTPRINTS\Altium_Footprint_Lib.PcbLib; PCB Footprint: CAP0402_0-75
C47 = CAP_Dup2: CAP CERAMIC 1uF 16V 20% X5R 0201; Part_type: CAPACITORS\CERAMIC; Mfr_part_number: GRM033R61C105ME15D; Mfr_name: MURATA; Mistral Part No: 120018090038-R; Custom_Duty: 15%; Customs_HS_Code: 85322990; Wattage: NA; Project: QCS610_NANOSOM; Footprint Ref: CAP0201_0-5; Library Ref: CAP; Footprint Path: Y:\MIS_DATABASE\Library\ALTIUM_TOOL\PCB_FOOTPRINTS\Altium_Footprint_Lib.PcbLib; Library Path: Y:\MIS_DATABASE\Library\ALTIUM_TOOL\SCHEMATICS_PARTS\MS_DISCRETE_Library.schlib; MECHANICAL 3D STEP FILE: CAP0201_0-5; Chkd/date: MANIRAJA/300520; Crtd /date: ALVY/260520; Datasheet: Y:\MIS_DATABASE\DATASHEETS\CAPACITORS\GRM033R61C105ME15.PDF; Temperature: -55°C+85°C; Weight: 0.33mg; Height: 0.39MM; Distributor_part_number: 490-18654-1-ND; Distributor_name: DIGIKEY; Package: 0201; Voltage: 16V; Tolerance: 20%; PCB Footprint: CAP0201_0-5
C60 = CAP_Dup2: CAP CERAMIC 4.7uF 10V 20% X5R 0402; Mistral Part No: 120012060002-R; Mfr_name: MURATA; Mfr_part_number: GRM155R61A475MEAAD; Part_type: CAPACITORS\CERAMIC; Project: TI_J7SVB_PCIE_ADD-ON-CARD; Wattage: NA; Customs_HS_Code: 85322990; Custom_Duty: 15%; Tolerance: 20%; Voltage: 10V; Package: 0402; Distributor_name: DIGIKEY; Distributor_part_number: 490-14306-1-ND; Height: 0.65MM; Weight: 14mg; Temperature: -55°C+85°C; Datasheet: Y:\MIS_DATABASE\DATASHEETS\CAPACITORS\GRM155R61A475MEAAD.PDF; Crtd /date: ALVY/110718; Chkd/date: MANIRAJA/110718; MECHANICAL 3D STEP FILE: CAP0402_0-75; Library Ref: CAP; Footprint Ref: CAP0402_0-75; Library Path: Y:\MIS_DATABASE\Library\ALTIUM_TOOL\SCHEMATICS_PARTS\MS_DISCRETE_Library.schlib; Footprint Path: Y:\MIS_DATABASE\Library\ALTIUM_TOOL\PCB_FOOTPRINTS\Altium_Footprint_Lib.PcbLib; PCB Footprint: CAP0402_0-75
C65 = CAP_Dup2: as C338 on sheet 18; MECHANICAL 3D STEP FILE: CAP0402_0-75; Chkd/date: ALVY/010721; Crtd /date: MANIRAJA/010721; Datasheet: Y:\MIS_DATABASE\DATASHEETS\CAPACITORS\GRM155R61E225KE11.PDF; Temperature: -55°C+85°C; Weight: 1.5mg; Height: 0.70MM; Library Ref: CAP; Distributor_part_number: 490-12703-1-ND; Distributor_name: DIGIKEY; Package: 0402; Voltage: 25V; Tolerance: 10%; Footprint Ref: CAP0402_0-75; Library Path: Y:\MIS_DATABASE\Library\ALTIUM_TOOL\SCHEMATICS_PARTS\MS_DISCRETE_Library.schlib; Footprint Path: Y:\MIS_DATABASE\Library\ALTIUM_TOOL\PCB_FOOTPRINTS\Altium_Footprint_Lib.PcbLib; PCB Footprint: CAP0402_0-75
C72 = CAP_Dup2: as C335 on sheet 18; Footprint Path: Y:\MIS_DATABASE\Library\ALTIUM_TOOL\PCB_FOOTPRINTS\Altium_Footprint_Lib.PcbLib; Library Path: Y:\MIS_DATABASE\Library\ALTIUM_TOOL\SCHEMATICS_PARTS\MS_DISCRETE_Library.schlib; Footprint Ref: CAP0402_0-75; Library Ref: CAP; MECHANICAL 3D STEP FILE: CAP0402_0-75; Chkd/date: MANIRAJA/261020; Crtd /date: ALVY/211020; Datasheet: Y:\MIS_DATABASE\DATASHEETS\CAPACITORS\GRM155R71H104KE14.PDF; Temperature: -55°C+125°C; Weight: 3.1mg; Height: 0.55MM; Distributor_part_number: 490-10700-1-ND; Distributor_name: DIGIKEY; Package: 0402; Voltage: 50V; Tolerance: 10%; PCB Footprint: CAP0402_0-75
FL8 = EMIFILTER_IND: IND FERRITE BEAD CHIP 120E 2A 0402; Part_type: INDUCTOR; Mfr_part_number: BLM15PX121SN1D; Mfr_name: MURATA; Mistral Part No: 130013060022-R; Custom_Duty: 24%; Customs_HS_Code: 85369090; Wattage: NA; Tolerance: 25%; Project: GEN_3-8; Footprint Path: Y:\MIS_DATABASE\Library\ALTIUM_TOOL\PCB_FOOTPRINTS\Altium_Footprint_Lib.PcbLib; Library Path: Y:\MIS_DATABASE\Library\ALTIUM_TOOL\SCHEMATICS_PARTS\MS_FILTER_Library.schlib; MECHANICAL 3D STEP FILE: EMIFIL_BLM15A_0402_0-6; Chkd/date: NAVEED/241114; Crtd /date: USMAN/170613; Datasheet: Y:\MIS_DATABASE\DATASHEETS\DISCRETES\INDUCTORS\BLM15-SN1-SER.PDF; Temperature: -55°C+125°C; Weight: 1mg; Height: 0.55MM; Library Ref: EMIFILTER_IND; Distributor_part_number: 490-9656-1-ND; Distributor_name: DIGIKEY; Package: 0402; Voltage: NA; Footprint Ref: EMIFIL_BLM15A_0402_0-6; PCB Footprint: EMIFIL_BLM15A_0402_0-6
J20 = CON_SDCARD9_MEM2075-00-140: CON MICROSD CARD 9POS FEMALE RT SMD; Mistral Part No: 150021090028-R; Mfr_name: GCT; Part_type: CONNECTOR\MEMORY CARD; Project: TI_AM62x SKEVM_BRD; Tolerance: NA; Customs_HS_Code: 85369090; Custom_Duty: 24%; Footprint Ref: CON_SD9_MEM2051-00-195-00_S_R_S_2-1; Mfr_part_number: MEM2051-00-195-00-A; Voltage: NA; Wattage: NA; Package: SMD; Distributor_name: DIGIKEY; Distributor_part_number: 2073-MEM2051-00-195-00-ACT-ND; Library Ref: CON_SDCARD9_MEM2075-00-140; Height: 2.05MM; Weight: 1000mg; Temperature: -40°C+85°C; Datasheet: Y:\MIS_DATABASE\DATASHEETS\CONNECTORS\MEM2051-00-195-00-A.PDF; Crtd /date: ALVY/240921; Chkd/date: MANIRAJA/270921; MECHANICAL 3D STEP FILE: CON_SD9_MEM2051-00-195-00_S_R_S_2-1; Library Path: Y:\MIS_DATABASE\Library\ALTIUM_TOOL\SCHEMATICS_PARTS\MS_CONNECTOR_Library.schlib; Footprint Path: Y:\MIS_DATABASE\Library\ALTIUM_TOOL\PCB_FOOTPRINTS\Altium_Footprint_Lib.PcbLib; PCB Footprint: CON_SD9_MEM2051-00-195-00_S_R_S_2-1
R80-R82 R90-R92 R96 = RESISTOR_Dup6: as R427 on sheet 18; MECHANICAL 3D STEP FILE: RES0201_0-5; Chkd/date: MANIRAJA/050517; Crtd /date: MANIRAJA/050517; Datasheet: Y:\MIS_DATABASE\DATASHEETS\RESISTORS\RCXXXXL-SER_MAR18.PDF; Temperature: -55°C+125°C; Weight: 0.17mg; Height: 0.26MM; Distributor_part_number: 311-10KNCT-ND; Distributor_name: DIGIKEY; Package: 0201; Wattage: 1/20W; Tolerance: 5%; Library Ref: RESISTOR; Footprint Ref: RES0201_0-5; Library Path: Y:\MIS_DATABASE\Library\ALTIUM_TOOL\SCHEMATICS_PARTS\MS_DISCRETE_Library.schlib; Footprint Path: Y:\MIS_DATABASE\Library\ALTIUM_TOOL\PCB_FOOTPRINTS\Altium_Footprint_Lib.PcbLib; PCB Footprint: RES0201_0-5
R117 R374 = RESISTOR_Dup6: RES 10K 1/20W 5% 0201; Mistral Part No: 110010070051-R; Mfr_name: YAGEO AMERICA; Mfr_part_number: RC0201JR-0710KL; Part_type: RESISTORS\FIXED; Project: GOLDEN-I LITE; Voltage: NA; Customs_HS_Code: 85332119; Custom_Duty: 15%; Footprint Path: Y:\MIS_DATABASE\Library\ALTIUM_TOOL\PCB_FOOTPRINTS\Altium_Footprint_Lib.PcbLib; Library Path: Y:\MIS_DATABASE\Library\ALTIUM_TOOL\SCHEMATICS_PARTS\MS_DISCRETE_Library.schlib; Footprint Ref: RES0201_0-5; Library Ref: RESISTOR; Tolerance: 5%; Wattage: 1/20W; Package: 0201; Distributor_name: DIGIKEY; Distributor_part_number: 311-10KNCT-ND; Height: 0.26MM; Weight: 0.17mg; Temperature: -55°C+125°C; Datasheet: Y:\MIS_DATABASE\DATASHEETS\RESISTORS\RCXXXXL-SER_MAR18.PDF; Crtd /date: MANIRAJA/050517; Chkd/date: MANIRAJA/050517; MECHANICAL 3D STEP FILE: RES0201_0-5; PCB Footprint: RES0201_0-5
U13 = TPS22918DBVR_SOT23-6: IC ON RESISTANCE LOAD SWITCH SOT23-6; Part_type: ICS\POWER; Mfr_name: TEXAS INSTRUMENTS; Mistral Part No: 142016050007-R; Automotive Alternate_mfr_part_number: TPS22918TDBVRQ1; Custom_Duty: 15%; Customs_HS_Code: 85423100; Wattage: NA; Project: TMDXCSK8127; Chkd/date: VASANTHA/130516; Crtd /date: VASANTHA/130516; Datasheet: Y:\MIS_DATABASE\DATASHEETS\ICS\POWER\TPS22918DBV.PDF; Temperature: -40°C to 105°C; Weight: NA; Height: 1.45MM; Library Ref: TPS22918DBVR_SOT23-6; Distributor_part_number: TPS22918DBVR-ND; Distributor_name: DIGIKEY; Package: SOT23-6; Voltage: NA; Tolerance: NA; Mfr_part_number: TPS22918DBVR; Automotive Alternate_mfr_name: TEXAS INSTRUMENTS; PCB Footprint: SOT23-6
U15 = TPD6E001RSE_UQFN10: IC 6CH ESD-PROTECTION ARRAY UQFN10; Part_type: ICS\INTERFACE; Mfr_name: TEXAS INSTRUMENTS; Mistral Part No: 141011080020-R; IBISSP_MODLES: Y:\MIS_DATABASE\IBIS\ICs\INTERFACE\TPD6E001RSE.IBS; Custom_Duty: 15%; Customs_HS_Code: 85423100; Wattage: NA; Project: DM385EVM_BASE-BOARD; MECHANICAL 3D STEP FILE: UQFN10_19-68_80X60_0-6; Chkd/date: USMAN/070612; Crtd /date: BAVISH/160811; Datasheet: Y:\MIS_DATABASE\DATASHEETS\ICS\INTERFACE\TPD6E001.PDF; Temperature: -40°C+85°C; Weight: 7mg; Height: 0.60MM; Distributor_part_number: 296-21888-1-ND; Distributor_name: DIGIKEY; Package: UQFN10; Voltage: NA; Tolerance: NA; Mfr_part_number: TPD6E001RSER; Library Ref: TPD6E001RSE_UQFN10; Footprint Ref: UQFN10_19-68_80X60_0-6; Library Path: Y:\MIS_DATABASE\Library\ALTIUM_TOOL\SCHEMATICS_PARTS\MS_MISCINTERFACE_Library.schlib; Footprint Path: Y:\MIS_DATABASE\Library\ALTIUM_TOOL\PCB_FOOTPRINTS\Altium_Footprint_Lib.PcbLib; PCB Footprint: UQFN10_19-68_80X60_0-6
U18 = TPD2E001DRLR_SOT-5: IC ESD-PROTECTION DIODE ARRAYS SOT-5; Part_type: ICS\ANALOG\ACTIVE FILTER; Mfr_name: TEXAS INSTRUMENTS; Mistral Part No: 140110060007-R; Custom_Duty: 15%; Customs_HS_Code: 85423100; Wattage: NA; Project: CENTAURUS; Footprint Path: Y:\MIS_DATABASE\Library\ALTIUM_TOOL\PCB_FOOTPRINTS\Altium_Footprint_Lib.PcbLib; Library Path: Y:\MIS_DATABASE\Library\ALTIUM_TOOL\SCHEMATICS_PARTS\MS_FILTER_Library.schlib; MECHANICAL 3D STEP FILE: SOT553-5_0-6; Chkd/date: NAVEED/150714; Crtd /date: MUDDU/250510; Datasheet: Y:\MIS_DATABASE\DATASHEETS\ICS\MISC\TPD2E001DRLR.PDF; Temperature: -40°C+85°C; Weight: 2.8mg; Height: 0.60MM; Footprint Ref: SOT553-5_0-6; Library Ref: TPD2E001DRLR_SOT-5; Distributor_part_number: 296-21883-1-ND; Distributor_name: DIGIKEY; Package: SOT-5; Voltage: NA; Tolerance: NA; Mfr_part_number: TPD2E001DRLR; PCB Footprint: SOT553-5_0-6
U22 = SN74LVC1G11DCKR_SC70-6: IC SINGLE 3-INPUT POSITIVE-AND GATE SON6; Mistral Part No: 141021010013-R; Mfr_name: TEXAS INSTRUMENTS; Part_type: ICS\DIGITAL\GATES; Project: AM64X_SKEVM; Tolerance: NA; Customs_HS_Code: 85423100; Custom_Duty: 15%; Footprint Ref: SON6_SN74LVC2G17_40X60_0-6; Mfr_part_number: SN74LVC1G11DRYR; Voltage: NA; Wattage: NA; Package: SON6; Distributor_name: DIGIKEY; Distributor_part_number: 296-30120-1-ND; Library Ref: SN74LVC1G11DCKR_SC70-6; Height: 0.60MM; Weight: 33mg; Temperature: -40°C+125°C; Datasheet: Y:\MIS_DATABASE\DATASHEETS\ICS\DIGITAL\GATES\SN74LVC1G_NOV16.PDF; Crtd /date: ALVY/270121; Chkd/date: MANIRAJA/270121; MECHANICAL 3D STEP FILE: SON6_SN74LVC2G17_40X60_0-6; Library Path: Y:\MIS_DATABASE\Library\ALTIUM_TOOL\SCHEMATICS_PARTS\MS_GATE_Library.schlib; Footprint Path: Y:\MIS_DATABASE\Library\ALTIUM_TOOL\PCB_FOOTPRINTS\Altium_Footprint_Lib.PcbLib; PCB Footprint: SON6_SN74LVC2G17_40X60_0-6